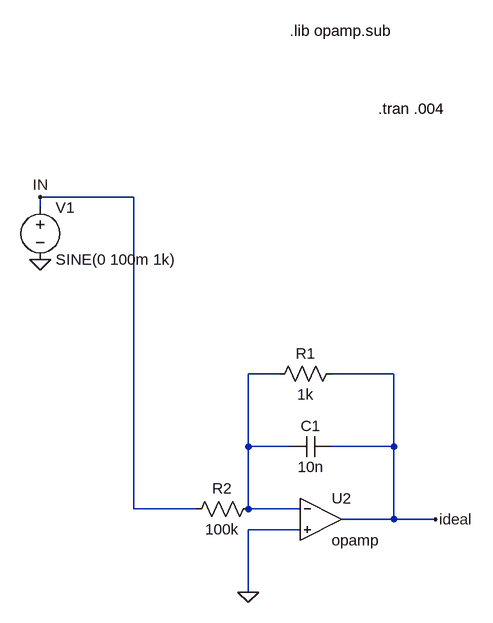
[diagram p0: schematic Draft7.asc]
Draft7.asc, the LTspice schematic file:
Version 4
SHEET 1 880 720
WIRE 192 96 48 96
WIRE 48 112 48 96
WIRE 416 368 368 368
WIRE 592 368 496 368
WIRE 368 480 368 368
WIRE 432 480 368 480
WIRE 592 480 592 368
WIRE 592 480 496 480
WIRE 192 576 192 96
WIRE 288 576 192 576
WIRE 368 576 368 480
WIRE 448 576 368 576
WIRE 592 592 592 480
WIRE 592 592 512 592
WIRE 656 592 592 592
WIRE 448 608 368 608
WIRE 368 704 368 608
FLAG 48 192 0
FLAG 48 96 IN
FLAG 368 704 0
FLAG 656 592 ideal
SYMBOL voltage 48 96 R0
SYMATTR InstName V1
SYMATTR Value SINE(0 100m 1k)
SYMBOL cap 496 464 R90
WINDOW 0 0 32 VBottom 2
WINDOW 3 32 32 VTop 2
SYMATTR InstName C1
SYMATTR Value 10n
SYMBOL res 384 560 R90
WINDOW 0 0 56 VBottom 2
WINDOW 3 32 56 VTop 2
SYMATTR InstName R2
SYMATTR Value 100k
SYMBOL Opamps/opamp 480 528 R0
SYMATTR InstName U2
SYMBOL res 512 352 R90
WINDOW 0 0 56 VBottom 2
WINDOW 3 32 56 VTop 2
SYMATTR InstName R1
SYMATTR Value 1k
TEXT 432 -160 Left 2 !.lib opamp.sub
TEXT 568 -40 Left 2 !.tran .004

The netlist it stands for:
* Draft7.asc
V1 IN 0 SINE(0 100m 1k)
C1 ideal N001 10n
R2 N001 IN 100k
XU2 N001 0 ideal opamp Aol=100K GBW=10Meg  ; pins invin noninvin out
R1 ideal N001 1k
.lib opamp.sub
.tran .004
.backanno
.end